# Altium schematic sheet Top.SchDoc
size D
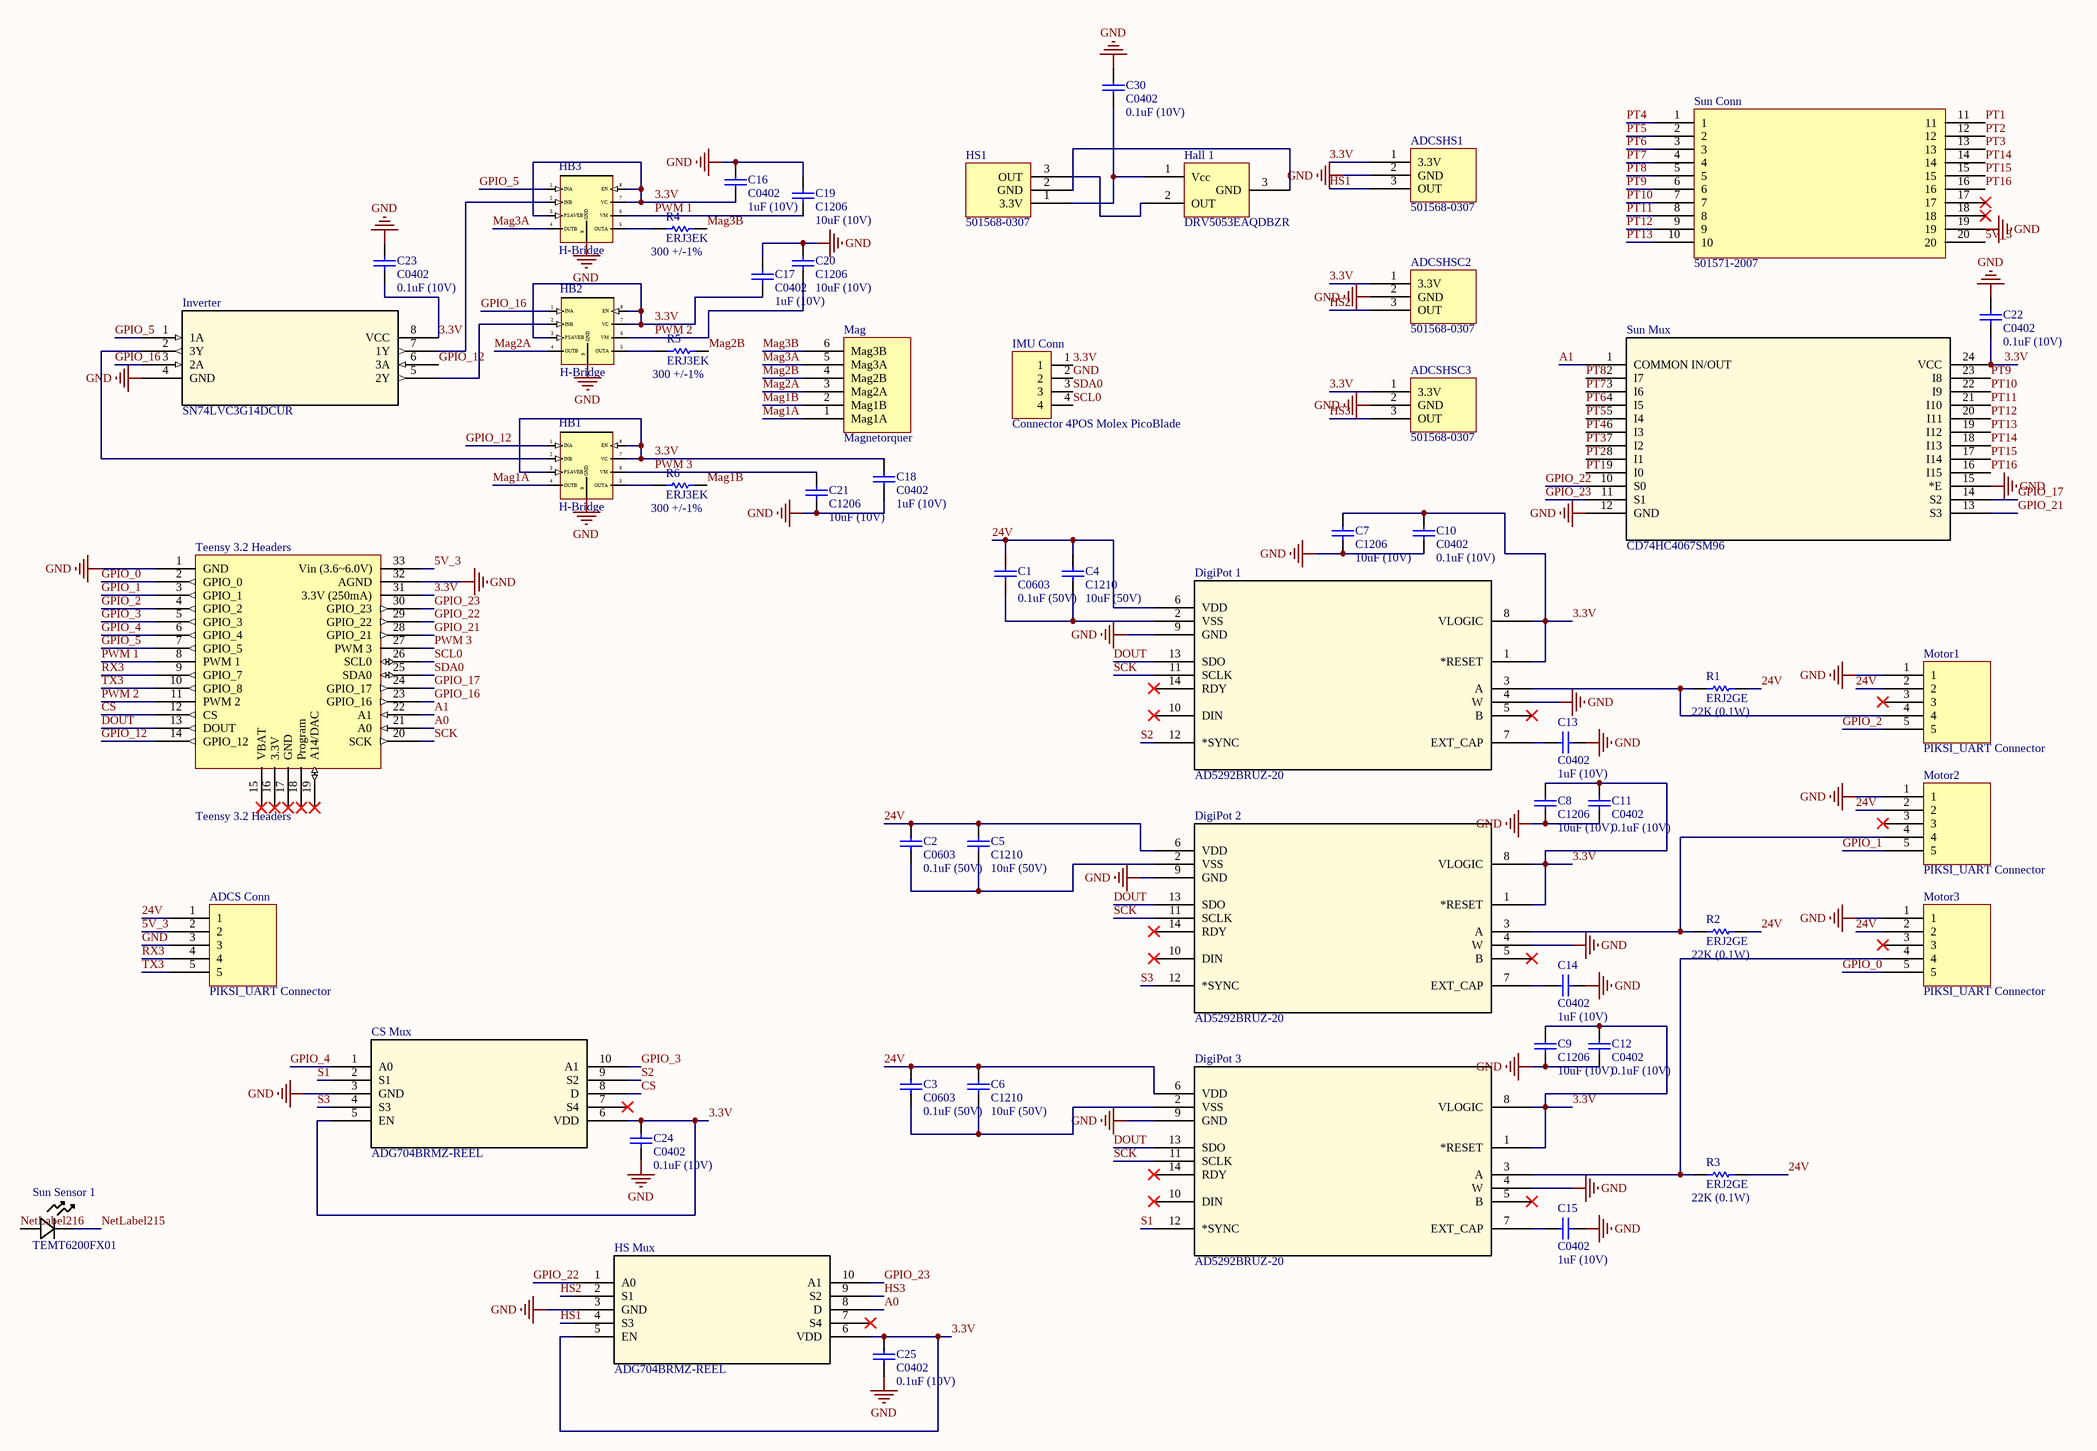
[diagram p0: Top.SchDoc]

## Parts
ADCS_Conn  PIKSI_UART Connector  [Molex Picoblade 5 Pin]
ADCSHS1  501568-0307  [5015680307]
ADCSHSC2  501568-0307  [5015680307]
ADCSHSC3  501568-0307  [5015680307]
C1  C0603  value 0.1uF (50V)  [0603]
C2  C0603  value 0.1uF (50V)  [0603]
C3  C0603  value 0.1uF (50V)  [0603]
C4  C1210  value 10uF (50V)  [1210]
C5  C1210  value 10uF (50V)  [1210]
C6  C1210  value 10uF (50V)  [1210]
C7  C1206  value 10uF (10V)  [1206]
C8  C1206  value 10uF (10V)  [1206]
C9  C1206  value 10uF (10V)  [1206]
C10  C0402  value 0.1uF (10V)  [0402]
C11  C0402  value 0.1uF (10V)  [0402]
C12  C0402  value 0.1uF (10V)  [0402]
C13  C0402  value 1uF (10V)  [0402]
C14  C0402  value 1uF (10V)  [0402]
C15  C0402  value 1uF (10V)  [0402]
C16  C0402  value 1uF (10V)  [0402]
C17  C0402  value 1uF (10V)  [0402]
C18  C0402  value 1uF (10V)  [0402]
C19  C1206  value 10uF (10V)  [1206]
C20  C1206  value 10uF (10V)  [1206]
C21  C1206  value 10uF (10V)  [1206]
C22  C0402  value 0.1uF (10V)  [0402]
C23  C0402  value 0.1uF (10V)  [0402]
C24  C0402  value 0.1uF (10V)  [0402]
C25  C0402  value 0.1uF (10V)  [0402]
C30  C0402  value 0.1uF (10V)  [0402]
CS_Mux  ADG704BRMZ-REEL  [ADG704BRMZ-REEL]
DigiPot_1  AD5292BRUZ-20  [AD5292BRUZ-20]
DigiPot_2  AD5292BRUZ-20  [AD5292BRUZ-20]
DigiPot_3  AD5292BRUZ-20  [AD5292BRUZ-20]
Hall_1  DRV5053EAQDBZR  [DRV5053EAQDBZR]
HB1  H-Bridge  [AP1017]
HB2  H-Bridge  [AP1017]
HB3  H-Bridge  [AP1017]
HS1  501568-0307  [5015680307]
HS_Mux  ADG704BRMZ-REEL  [ADG704BRMZ-REEL]
IMU_Conn  Connector 4POS Molex PicoBlade  [532610471]
Inverter  SN74LVC3G14DCUR  [SN74LVC3G14DCUR]
Mag  Magnetorquer  [Pressure Connector]
Motor1  PIKSI_UART Connector  [Molex Picoblade 5 Pin]
Motor2  PIKSI_UART Connector  [Molex Picoblade 5 Pin]
Motor3  PIKSI_UART Connector  [Molex Picoblade 5 Pin]
R1  ERJ2GE  value 22K (0.1W)  [2-0402]
R2  ERJ2GE  value 22K (0.1W)  [2-0402]
R3  ERJ2GE  value 22K (0.1W)  [2-0402]
R4  ERJ3EK  Resistance: 300 +/-1%  [3-0603]
R5  ERJ3EK  Resistance: 300 +/-1%  [3-0603]
R6  ERJ3EK  Resistance: 300 +/-1%  [3-0603]
Sun_Conn  501571-2007  [501571-2007 20Pos Conn]
Sun_Mux  CD74HC4067SM96  [CD74HC4067SM96]
Sun_Sensor_1  TEMT6200FX01  [Phototransistor]
Teensy_3.2_Headers  Teensy 3.2 Headers  [Teensy 3.2 with Headers]

## Nets
GND: ADCS_Conn.3 ADCSHS1.2(GND) ADCSHSC2.2(GND) ADCSHSC3.2(GND) C7.1 C8.1 C9.1 C10.1 C11.1 C12.1 C13.2 C14.2 C15.2 C16.2 C17.2 C18.1 C19.2 C20.2 C21.1 C22.2 C23.2 C24.1 C25.1 C30.2 CS_Mux.3(GND) DigiPot_1.4(W) DigiPot_1.9(GND) DigiPot_2.4(W) DigiPot_2.9(GND) DigiPot_3.4(W) DigiPot_3.9(GND) HB1.9(GND) HB2.9(GND) HB3.9(GND) HS_Mux.3(GND) IMU_Conn.2 Inverter.4(GND) Motor1.1 Motor2.1 Motor3.1 Sun_Conn.19 Sun_Mux.12(GND) Sun_Mux.15(*E) Teensy_3.2_Headers.1(GND) Teensy_3.2_Headers.32(AGND)
3.3V: ADCSHS1.1(3.3V) ADCSHSC2.1(3.3V) ADCSHSC3.1(3.3V) C7.2 C8.2 C9.2 C10.2 C11.2 C12.2 C16.1 C17.1 C18.2 C22.1 C23.1 C24.2 C25.2 CS_Mux.5(EN) CS_Mux.6(VDD) DigiPot_1.1(*RESET) DigiPot_1.8(VLOGIC) DigiPot_2.1(*RESET) DigiPot_2.8(VLOGIC) DigiPot_3.1(*RESET) DigiPot_3.8(VLOGIC) HB1.3(PSAVEB) HB1.7(VC) HB1.8(EN) HB2.3(PSAVEB) HB2.7(VC) HB2.8(EN) HB3.3(PSAVEB) HB3.7(VC) HB3.8(EN) HS_Mux.5(EN) HS_Mux.6(VDD) IMU_Conn.1 Inverter.8(VCC) Sun_Mux.24(VCC) Teensy_3.2_Headers.31(3.3V_(250mA))
5V_3: ADCS_Conn.2 Sun_Conn.20 Teensy_3.2_Headers.33(Vin_(3.6~6.0V))
24V: ADCS_Conn.1 C1.2 C2.2 C3.2 C4.2 C5.2 C6.2 DigiPot_1.6(VDD) DigiPot_2.6(VDD) DigiPot_3.6(VDD) Motor1.2 Motor2.2 Motor3.2 R1.2 R2.2 R3.2
A0: HS_Mux.8(D) Teensy_3.2_Headers.21(A0)
A1: Sun_Mux.1(COMMON_IN/OUT) Teensy_3.2_Headers.22(A1)
CS: CS_Mux.8(D) Teensy_3.2_Headers.12(CS)
DOUT: DigiPot_1.13(SDO) DigiPot_2.13(SDO) DigiPot_3.13(SDO) Teensy_3.2_Headers.13(DOUT)
GPIO_0: Motor3.5 Teensy_3.2_Headers.2(GPIO_0)
GPIO_1: Motor2.5 Teensy_3.2_Headers.3(GPIO_1)
GPIO_2: Motor1.5 Teensy_3.2_Headers.4(GPIO_2)
GPIO_3: CS_Mux.10(A1) Teensy_3.2_Headers.5(GPIO_3)
GPIO_4: CS_Mux.1(A0) Teensy_3.2_Headers.6(GPIO_4)
GPIO_5: HB3.1(INA) Inverter.1(1A) Teensy_3.2_Headers.7(GPIO_5)
GPIO_12: HB1.1(INA) Inverter.6(3A) Teensy_3.2_Headers.14(GPIO_12)
GPIO_16: HB2.1(INA) Inverter.3(2A) Teensy_3.2_Headers.23(GPIO_16)
GPIO_17: Sun_Mux.14(S2) Teensy_3.2_Headers.24(GPIO_17)
GPIO_21: Sun_Mux.13(S3) Teensy_3.2_Headers.28(GPIO_21)
GPIO_22: HS_Mux.1(A0) Sun_Mux.10(S0) Teensy_3.2_Headers.29(GPIO_22)
GPIO_23: HS_Mux.10(A1) Sun_Mux.11(S1) Teensy_3.2_Headers.30(GPIO_23)
HS1: ADCSHS1.3(OUT) HS_Mux.4(S3)
HS2: ADCSHSC2.3(OUT) HS_Mux.2(S1)
HS3: ADCSHSC3.3(OUT) HS_Mux.9(S2)
Mag1A: HB1.4(OUTB) Mag.1(Mag1A)
Mag1B: Mag.2(Mag1B) R6.2
Mag2A: HB2.4(OUTB) Mag.3(Mag2A)
Mag2B: Mag.4(Mag2B) R5.2
Mag3A: HB3.4(OUTB) Mag.5(Mag3A)
Mag3B: Mag.6(Mag3B) R4.2
NetLabel215: Sun_Sensor_1.1
NetLabel216: Sun_Sensor_1.2
PT1: Sun_Conn.11 Sun_Mux.9(I0)
PT2: Sun_Conn.12 Sun_Mux.8(I1)
PT3: Sun_Conn.13 Sun_Mux.7(I2)
PT4: Sun_Conn.1 Sun_Mux.6(I3)
PT5: Sun_Conn.2 Sun_Mux.5(I4)
PT6: Sun_Conn.3 Sun_Mux.4(I5)
PT7: Sun_Conn.4 Sun_Mux.3(I6)
PT8: Sun_Conn.5 Sun_Mux.2(I7)
PT9: Sun_Conn.6 Sun_Mux.23(I8)
PT10: Sun_Conn.7 Sun_Mux.22(I9)
PT11: Sun_Conn.8 Sun_Mux.21(I10)
PT12: Sun_Conn.9 Sun_Mux.20(I11)
PT13: Sun_Conn.10 Sun_Mux.19(I12)
PT14: Sun_Conn.14 Sun_Mux.18(I13)
PT15: Sun_Conn.15 Sun_Mux.17(I14)
PT16: Sun_Conn.16 Sun_Mux.16(I15)
PWM 1: C19.1 HB3.6(VM) Teensy_3.2_Headers.8(PWM_1)
PWM 2: C20.1 HB2.6(VM) Teensy_3.2_Headers.11(PWM_2)
PWM 3: C21.2 HB1.6(VM) Teensy_3.2_Headers.27(PWM_3)
RX3: ADCS_Conn.4 Teensy_3.2_Headers.9(GPIO_7)
S1: CS_Mux.2(S1) DigiPot_3.12(*SYNC)
S2: CS_Mux.9(S2) DigiPot_1.12(*SYNC)
S3: CS_Mux.4(S3) DigiPot_2.12(*SYNC)
SCK: DigiPot_1.11(SCLK) DigiPot_2.11(SCLK) DigiPot_3.11(SCLK) Teensy_3.2_Headers.20(SCK)
SCL0: IMU_Conn.4 Teensy_3.2_Headers.26(SCL0)
SDA0: IMU_Conn.3 Teensy_3.2_Headers.25(SDA0)
TX3: ADCS_Conn.5 Teensy_3.2_Headers.10(GPIO_8)
NetC1_1: C1.1 C4.1 DigiPot_1.2(VSS)
NetC2_1: C2.1 C5.1 DigiPot_2.2(VSS)
NetC3_1: C3.1 C6.1 DigiPot_3.2(VSS)
NetC13_1: C13.1 DigiPot_1.7(EXT_CAP)
NetC14_1: C14.1 DigiPot_2.7(EXT_CAP)
NetC15_1: C15.1 DigiPot_3.7(EXT_CAP)
NetC30_1: C30.1 Hall_1.1(Vcc) HS1.1(3.3V)
NetDigiPot_1_3: DigiPot_1.3(A) Motor1.4 R1.1
NetDigiPot_2_3: DigiPot_2.3(A) Motor2.4 R2.1
NetDigiPot_3_3: DigiPot_3.3(A) Motor3.4 R3.1
NetHall_1_2: Hall_1.2(OUT) HS1.3(OUT)
NetHall_1_3: Hall_1.3(GND) HS1.2(GND)
NetHB1_2: HB1.2(INB) Inverter.2(3Y)
NetHB1_5: HB1.5(OUTA) R6.1
NetHB2_2: HB2.2(INB) Inverter.5(2Y)
NetHB2_5: HB2.5(OUTA) R5.1
NetHB3_2: HB3.2(INB) Inverter.7(1Y)
NetHB3_5: HB3.5(OUTA) R4.1

Not connected (* = marked no-connect by the designer): CS_Mux 7(S4)*; DigiPot_1 5(B)* 10(DIN)* 14(RDY)*; DigiPot_2 5(B)* 10(DIN)* 14(RDY)*; DigiPot_3 5(B)* 10(DIN)* 14(RDY)*; HS_Mux 7(S4)*; Motor1 3*; Motor2 3*; Motor3 3*; Sun_Conn 17* 18*; Teensy_3.2_Headers 15(VBAT)* 16(3.3V)* 17(GND)* 18(Program)* 19(A14/DAC)*

## Library data of the parts
ADCS_Conn Motor1-Motor3 = PIKSI_UART Connector: Molex Picoblade 53261-0571
ADCSHS1 ADCSHSC2 ADCSHSC3 HS1 = 501568-0307: CONN HEADER 1MM 3POS
C1-C3 = C0603: Ceramic Chip Capacitor - Standard; Note: Footprint corresponds to dimensions for bulk cassette packaging. This case size has tightened tolerances.; Published: 17-Jul-2002; LatestRevisionDate: 19-Mar-2004; LatestRevisionNote: Silkscreen size reduced.; DatasheetDocument: Mar-2001; PackageDocument: Mar-2001; PackageReference: 0603; Publisher: Altium Limited; Code_JEITA: 0603; Code_IPC: 1608 [0603]; ComponentLink1Description: Manufacturer Link; ComponentLink1URL: http://www.kemet.com/; ComponentLink2Description: Datasheet; ComponentLink2URL: http://www.kemet.com/kemet/web/homepage/kechome.nsf/vapubfilesname/F3102TA.pdf/$file/F3102TA.pdf
C4-C6 = C1210: Ceramic Chip Capacitor - Standard; Published: 17-Jul-2002; LatestRevisionDate: 19-Mar-2004; LatestRevisionNote: Silkscreen size reduced.; DatasheetDocument: Mar-2001; PackageDocument: Mar-2001; PackageReference: 1210; Publisher: Altium Limited; Code_JEITA: 1210; Code_IPC: 3225 [1210]; ComponentLink1Description: Manufacturer Link; ComponentLink1URL: http://www.kemet.com/; ComponentLink2Description: Datasheet; ComponentLink2URL: http://www.kemet.com/kemet/web/homepage/kechome.nsf/vapubfilesname/F3102TA.pdf/$file/F3102TA.pdf
C7-C9 C19-C21 = C1206: Ceramic Chip Capacitor - Standard; Published: 17-Jul-2002; LatestRevisionDate: 19-Mar-2004; LatestRevisionNote: Silkscreen size reduced.; DatasheetDocument: Mar-2001; PackageDocument: Mar-2001; PackageReference: 1206; Publisher: Altium Limited; Code_JEITA: 1206; Code_IPC: 3216 [1206]; ComponentLink1Description: Manufacturer Link; ComponentLink1URL: http://www.kemet.com/; ComponentLink2Description: Datasheet; ComponentLink2URL: http://www.kemet.com/kemet/web/homepage/kechome.nsf/vapubfilesname/F3102TA.pdf/$file/F3102TA.pdf
C10-C18 C22-C25 C30 = C0402: Ceramic Chip Capacitor - Standard; Note: Footprint corresponds to dimensions for bulk cassette packaging. This case size has tightened tolerances.; Published: 17-Jul-2002; LatestRevisionDate: 19-Mar-2004; LatestRevisionNote: Silkscreen size reduced.; DatasheetDocument: Mar-2001; PackageDocument: Mar-2001; PackageReference: 0402; Publisher: Altium Limited; Code_JEITA: 0402; Code_IPC: 1005 [0402]; ComponentLink1Description: Manufacturer Link; ComponentLink1URL: http://www.kemet.com/; ComponentLink2Description: Datasheet; ComponentLink2URL: http://www.kemet.com/kemet/web/homepage/kechome.nsf/vapubfilesname/F3102TA.pdf/$file/F3102TA.pdf
DigiPot_1-DigiPot_3 = AD5292BRUZ-20: 20K DigiPot 1024POS
Hall_1 = DRV5053EAQDBZR: Hall Sensor Linear SOT-23-3
HB1-HB3 = AP1017AEN
IMU_Conn = 532610471
Mag = PressureConnector: Molex 70553-0005
R1-R3 = ERJ2GE: Thick Film Chip Resistor, 1 Ohm to 2.2M Ohm Range, 5% Tolerance, 0402 Size, 0.063 W; Note: If flow soldering, adjust pad width of PCB Footprint to 0.7 - 0.8 times the width of the resistor.; Published: 17-Dec-2003; LatestRevisionDate: 19-Mar-2004; LatestRevisionNote: Silkscreen size reduced.; PackageDocument: Mar-2003; PackageReference: 2-0402; Publisher: Altium Limited; Code_IPC: 1005 [0402]; ComponentLink1Description: Manufacturer Link; ComponentLink1URL: http://www.panasonic.com/industrial/components/resistive_products.htm; ComponentLink2Description: Datasheet; ComponentLink2URL: http://www.panasonic.com/industrial/components/pdf/AOA0000CE1.pdf
R4-R6 = ERJ3EK: Precision Thick Film Chip Resistor, 10 Ohm to 1M Ohm Range, 1% and 0.5% Tolerance, 0603 Size, 0.063 W; Published: 17-Dec-2003; LatestRevisionDate: 19-Mar-2004; LatestRevisionNote: Silkscreen size reduced.; PackageDocument: Mar-2003; PackageReference: 3-0603; Publisher: Altium Limited; Code_IPC: 1608 [0603]; ComponentLink1Description: Manufacturer Link; ComponentLink1URL: http://www.panasonic.com/industrial/components/resistive_products.htm; ComponentLink2Description: Datasheet; ComponentLink2URL: http://www.panasonic.com/industrial/components/pdf/AOA0000CE2.pdf
Sun_Conn = 501571-2007: Pico-Clasp 1.0mm 20POS